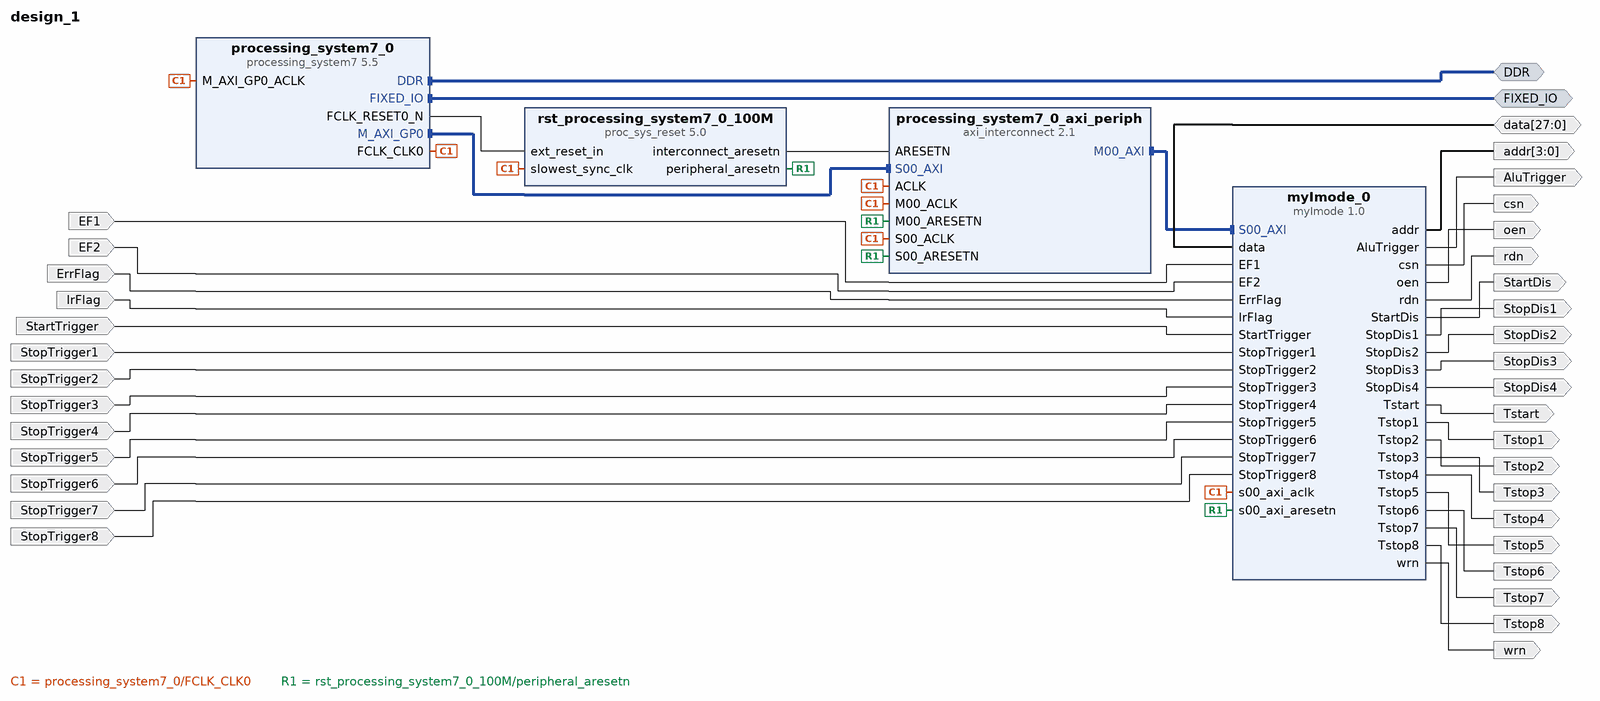
[diagram p0: block diagram of the top level]
# Vivado block design design_1, Vivado 2016.2
create_bd_design design_1

create_bd_intf_port -mode Master -vlnv xilinx.com:interface:ddrx_rtl:1.0 DDR
create_bd_intf_port -mode Master -vlnv xilinx.com:display_processing_system7:fixedio_rtl:1.0 FIXED_IO
create_bd_port -dir O -from 3 -to 0 addr
create_bd_port -dir O AluTrigger
create_bd_port -dir O csn
create_bd_port -dir IO -from 27 -to 0 data
create_bd_port -dir I EF1
create_bd_port -dir I EF2
create_bd_port -dir I ErrFlag
create_bd_port -dir I IrFlag
create_bd_port -dir O oen
create_bd_port -dir O rdn
create_bd_port -dir O StartDis
create_bd_port -dir I StartTrigger
create_bd_port -dir O StopDis1
create_bd_port -dir O StopDis2
create_bd_port -dir O StopDis3
create_bd_port -dir O StopDis4
create_bd_port -dir I StopTrigger1
create_bd_port -dir I StopTrigger2
create_bd_port -dir I StopTrigger3
create_bd_port -dir I StopTrigger4
create_bd_port -dir I StopTrigger5
create_bd_port -dir I StopTrigger6
create_bd_port -dir I StopTrigger7
create_bd_port -dir I StopTrigger8
create_bd_port -dir O Tstart
create_bd_port -dir O Tstop1
create_bd_port -dir O Tstop2
create_bd_port -dir O Tstop3
create_bd_port -dir O Tstop4
create_bd_port -dir O Tstop5
create_bd_port -dir O Tstop6
create_bd_port -dir O Tstop7
create_bd_port -dir O Tstop8
create_bd_port -dir O wrn

create_bd_cell -type ip -vlnv xilinx.com:ip:processing_system7:5.5 processing_system7_0
set_property -dict {CONFIG.PCW_QSPI_GRP_SINGLE_SS_ENABLE 1 CONFIG.preset ZedBoard} [get_bd_cells processing_system7_0]
# 2 more settings of processing_system7_0 are not shown: defaults, MIO pin electricals, DDR timing, and values the tool derives
create_bd_cell -type ip -vlnv xilinx.com:ip:axi_interconnect:2.1 processing_system7_0_axi_periph
set_property -dict {CONFIG.NUM_MI 1} [get_bd_cells processing_system7_0_axi_periph]
create_bd_cell -type ip -vlnv xilinx.com:ip:proc_sys_reset:5.0 rst_processing_system7_0_100M
create_bd_cell -type ip -vlnv xilinx.com:user:myImode:1.0 myImode_0

# ---- connections ----

connect_bd_intf_net [get_bd_intf_pins processing_system7_0/M_AXI_GP0] [get_bd_intf_pins processing_system7_0_axi_periph/S00_AXI]
connect_bd_intf_net [get_bd_intf_pins processing_system7_0_axi_periph/M00_AXI] [get_bd_intf_pins myImode_0/S00_AXI]
connect_bd_intf_net [get_bd_intf_ports DDR] [get_bd_intf_pins processing_system7_0/DDR]
connect_bd_intf_net [get_bd_intf_ports FIXED_IO] [get_bd_intf_pins processing_system7_0/FIXED_IO]
connect_bd_net [get_bd_pins myImode_0/addr] [get_bd_ports addr]
connect_bd_net [get_bd_pins myImode_0/AluTrigger] [get_bd_ports AluTrigger]
connect_bd_net [get_bd_pins myImode_0/csn] [get_bd_ports csn]
connect_bd_net [get_bd_ports data] [get_bd_pins myImode_0/data]
connect_bd_net -net EF1_1 [get_bd_ports EF1] [get_bd_pins myImode_0/EF1]
connect_bd_net -net EF2_1 [get_bd_ports EF2] [get_bd_pins myImode_0/EF2]
connect_bd_net [get_bd_ports ErrFlag] [get_bd_pins myImode_0/ErrFlag]
connect_bd_net [get_bd_ports IrFlag] [get_bd_pins myImode_0/IrFlag]
connect_bd_net [get_bd_pins myImode_0/oen] [get_bd_ports oen]
connect_bd_net [get_bd_pins myImode_0/rdn] [get_bd_ports rdn]
connect_bd_net [get_bd_pins myImode_0/StartDis] [get_bd_ports StartDis]
connect_bd_net [get_bd_ports StartTrigger] [get_bd_pins myImode_0/StartTrigger]
connect_bd_net [get_bd_pins myImode_0/StopDis1] [get_bd_ports StopDis1]
connect_bd_net [get_bd_pins myImode_0/StopDis2] [get_bd_ports StopDis2]
connect_bd_net [get_bd_pins myImode_0/StopDis3] [get_bd_ports StopDis3]
connect_bd_net [get_bd_pins myImode_0/StopDis4] [get_bd_ports StopDis4]
connect_bd_net -net StopTrigger1_1 [get_bd_ports StopTrigger1] [get_bd_pins myImode_0/StopTrigger1]
connect_bd_net -net StopTrigger2_1 [get_bd_ports StopTrigger2] [get_bd_pins myImode_0/StopTrigger2]
connect_bd_net -net StopTrigger3_1 [get_bd_ports StopTrigger3] [get_bd_pins myImode_0/StopTrigger3]
connect_bd_net -net StopTrigger4_1 [get_bd_ports StopTrigger4] [get_bd_pins myImode_0/StopTrigger4]
connect_bd_net -net StopTrigger5_1 [get_bd_ports StopTrigger5] [get_bd_pins myImode_0/StopTrigger5]
connect_bd_net -net StopTrigger6_1 [get_bd_ports StopTrigger6] [get_bd_pins myImode_0/StopTrigger6]
connect_bd_net -net StopTrigger7_1 [get_bd_ports StopTrigger7] [get_bd_pins myImode_0/StopTrigger7]
connect_bd_net -net StopTrigger8_1 [get_bd_ports StopTrigger8] [get_bd_pins myImode_0/StopTrigger8]
connect_bd_net [get_bd_pins myImode_0/Tstart] [get_bd_ports Tstart]
connect_bd_net [get_bd_pins myImode_0/Tstop1] [get_bd_ports Tstop1]
connect_bd_net [get_bd_pins myImode_0/Tstop2] [get_bd_ports Tstop2]
connect_bd_net [get_bd_pins myImode_0/Tstop3] [get_bd_ports Tstop3]
connect_bd_net [get_bd_pins myImode_0/Tstop4] [get_bd_ports Tstop4]
connect_bd_net [get_bd_pins myImode_0/Tstop5] [get_bd_ports Tstop5]
connect_bd_net [get_bd_pins myImode_0/Tstop6] [get_bd_ports Tstop6]
connect_bd_net [get_bd_pins myImode_0/Tstop7] [get_bd_ports Tstop7]
connect_bd_net [get_bd_pins myImode_0/Tstop8] [get_bd_ports Tstop8]
connect_bd_net [get_bd_pins myImode_0/wrn] [get_bd_ports wrn]
connect_bd_net [get_bd_pins processing_system7_0/FCLK_CLK0] \
  [get_bd_pins processing_system7_0/M_AXI_GP0_ACLK] [get_bd_pins rst_processing_system7_0_100M/slowest_sync_clk] \
  [get_bd_pins processing_system7_0_axi_periph/S00_ACLK] [get_bd_pins processing_system7_0_axi_periph/ACLK] \
  [get_bd_pins processing_system7_0_axi_periph/M00_ACLK] [get_bd_pins myImode_0/s00_axi_aclk]
connect_bd_net [get_bd_pins processing_system7_0/FCLK_RESET0_N] [get_bd_pins rst_processing_system7_0_100M/ext_reset_in]
connect_bd_net [get_bd_pins rst_processing_system7_0_100M/peripheral_aresetn] \
  [get_bd_pins processing_system7_0_axi_periph/S00_ARESETN] [get_bd_pins processing_system7_0_axi_periph/M00_ARESETN] \
  [get_bd_pins myImode_0/s00_axi_aresetn]
connect_bd_net [get_bd_pins rst_processing_system7_0_100M/interconnect_aresetn] [get_bd_pins processing_system7_0_axi_periph/ARESETN]

# ---- address map ----
assign_bd_address -offset 0x43C00000 -range 64K -target_address_space [get_bd_addr_spaces processing_system7_0/Data] [get_bd_addr_segs myImode_0/S00_AXI/S00_AXI_reg]

validate_bd_design
save_bd_design
